# EAGLE board OpenBook (EAGLE 9.7.0)
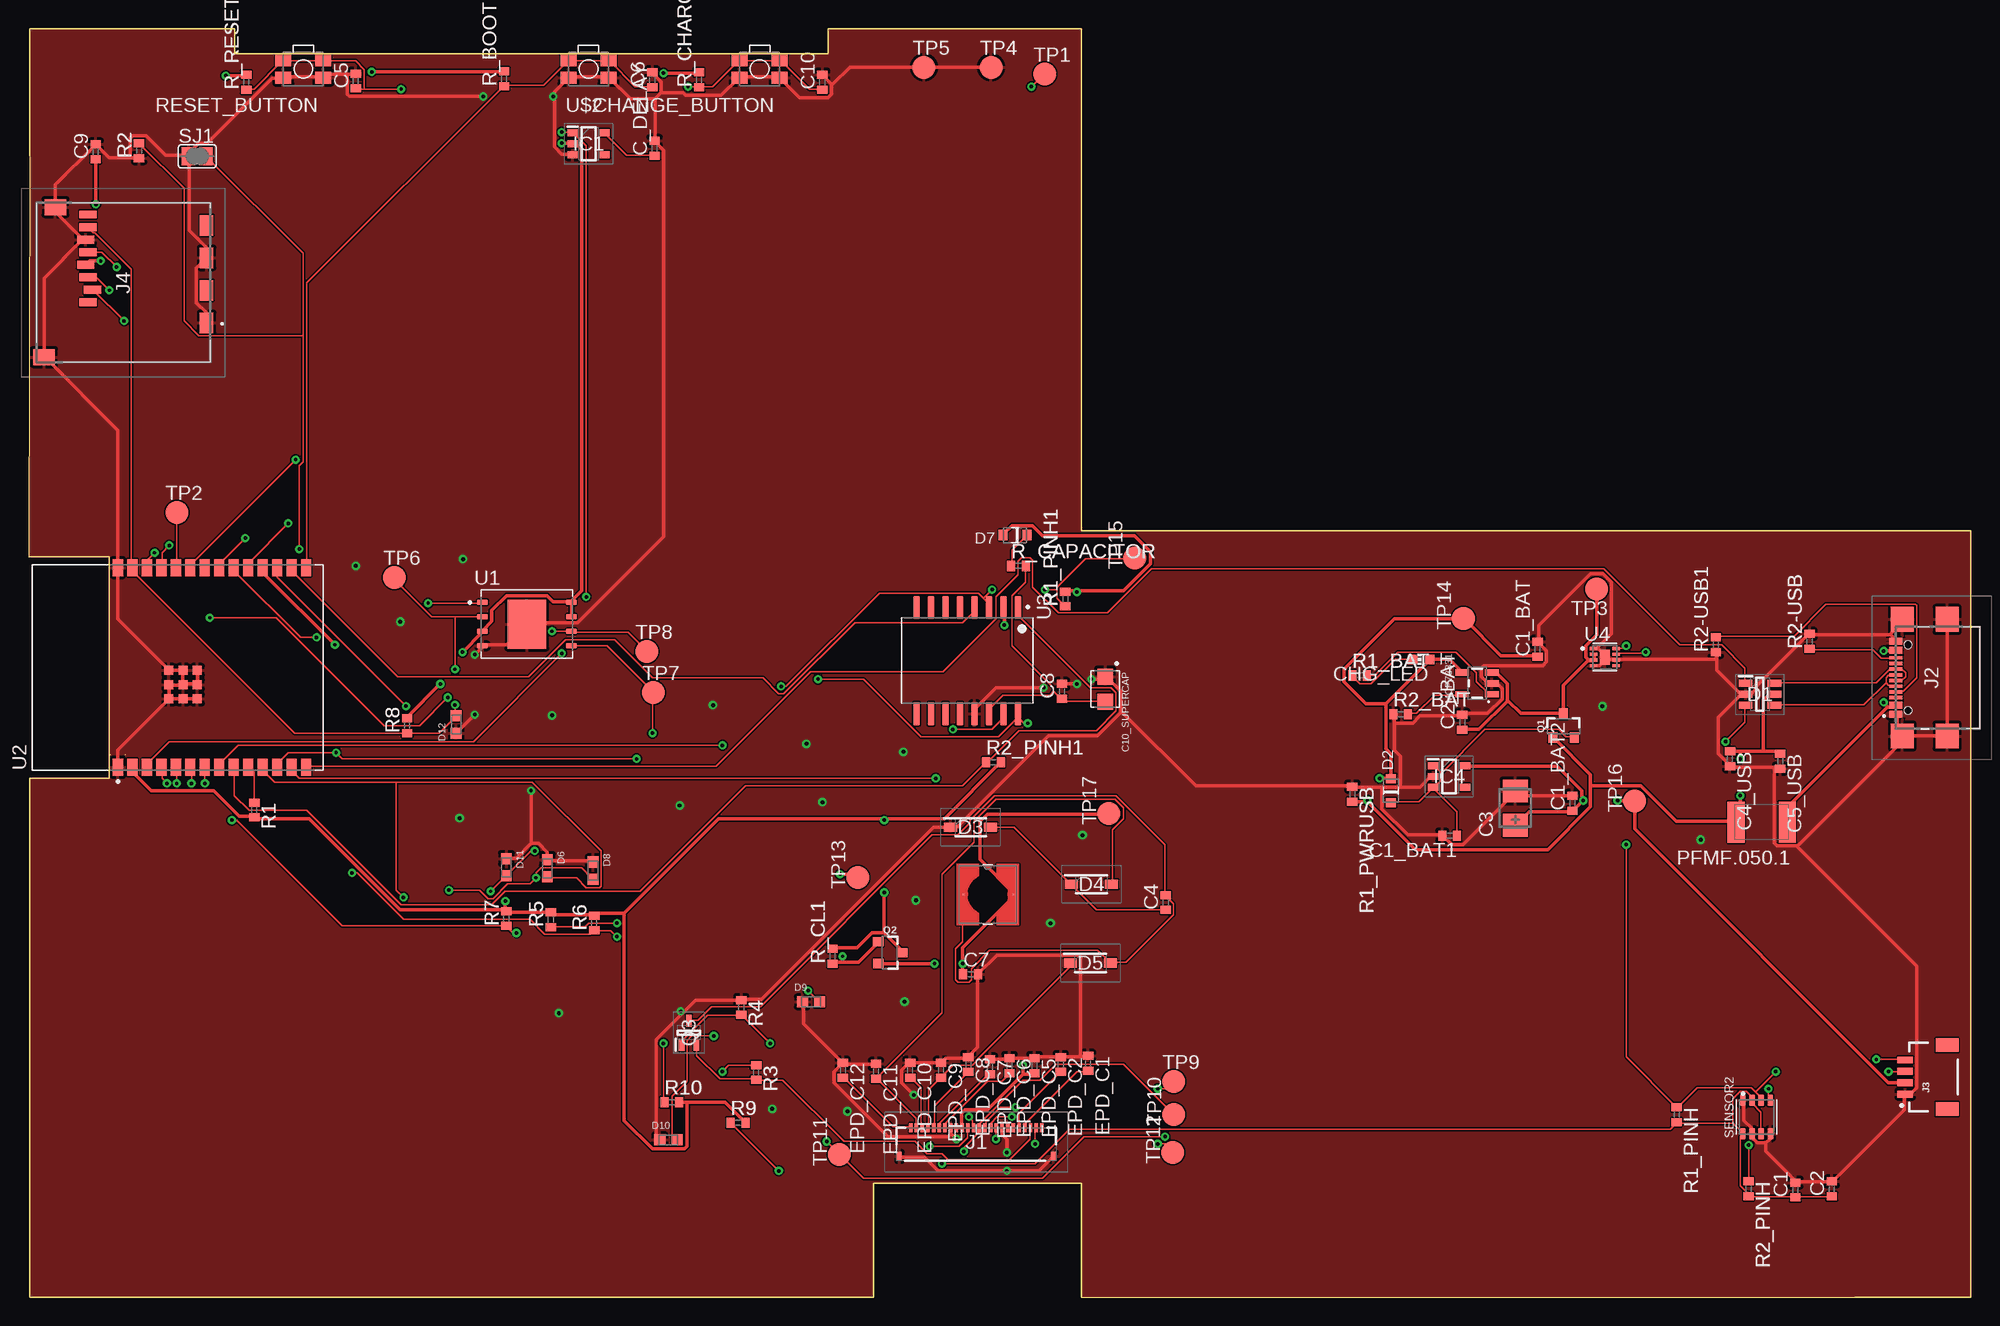
[diagram p1: board, top side]
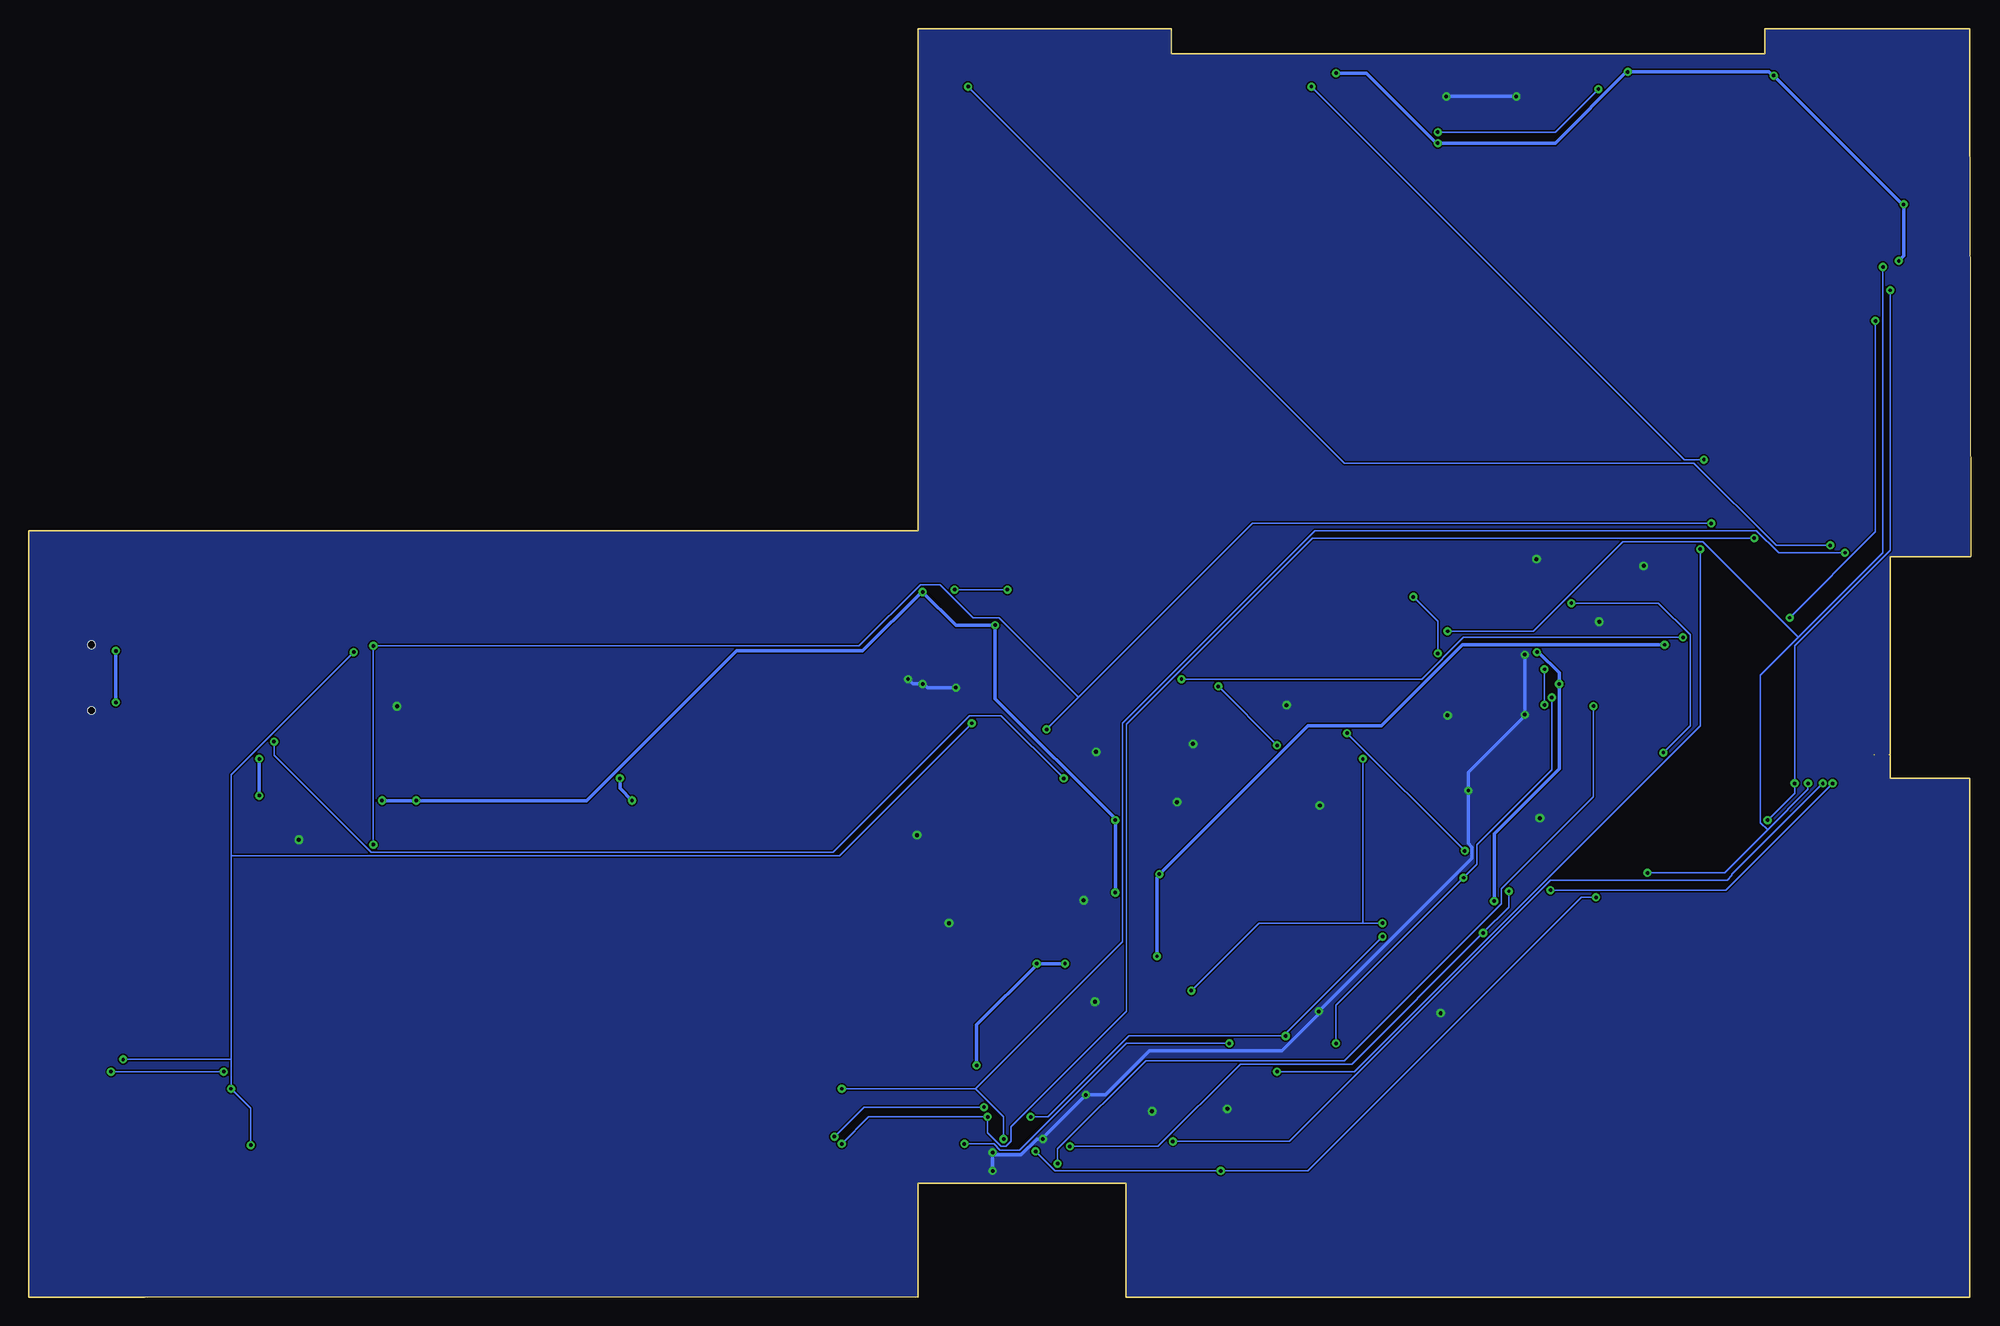
[diagram p2: board, bottom side, seen from below]

Size 170.29 x 111.2 mm. Coordinates in mm from the lower left corner, seen from the top.
Outline: 7.18,47.53 7.09,47.53
Outline: 8.48,47.53 8.49,47.53
Outline: 7.09,47.53 7.09,64.9 0,64.9 0.09,100 0.09,111.2 18.09,111.2 18.09,109 70.09,109 70.09,111.2 92.29,111.2 92.29,67.2 170.29,67.2 170.29,0 160.09,0 92.29,0 92.29,10 74.09,10 74.09,0 0.09,0 0.09,45.5 7.09,45.5 7.09,47.53
Copper layers (1*16): Top 0.035mm / dielectric 1.5mm / Bottom 0.035mm
Design rules "Fusion Electronics Design Rules *": minimum track width 0.15mm, minimum drill 0.3mm, track to track 0.13mm, track to pad 0.13mm, pad to pad 0.13mm, via to via 0.13mm, smd to smd 0.13mm, copper to edge 0mil, drill to drill 0.15mm, minimum pad ring 10mil, minimum via ring 8mil, stop-mask expansion 4mil, vias tented up to drill 9999mil, thermal gap 10mil
Net classes: 0 default: width 0.05 mm; 1 Power: width 0.3 mm; 2 Signal: width 0.15 mm

## Footprints (pad centres in the part's own frame; a part is rotated, then mirrored left to right if it is on the bottom)
ESP32_WROVER_EAGLE-LTSPICE_C0402 = smd 0.7 x 0.9: 1 -0.65,0; 2 0.65,0
RCL_CT3528 = smd 2 x 2.2: + -1.5,0; - 1.5,0
CAPCP3225X100N = smd 1.4 x 1.4: 1 -1.1,0; 2 1.1,0
MYBUTTON = smd 1.4 x 1.05: 1 1.75,0.75; 2 -1.75,0.75; 3 -1.75,-0.75; 4 1.75,-0.75
ADAFRUIT_CHIP-LED0603 = smd 0.8 x 0.8: A 0,-0.75; C 0,0.75
SOT95P280X145-6N = smd 1.2 x 0.6: 1 -1.25,0.95; 2 -1.25,0; 3 -1.25,-0.95; 4 1.25,-0.95; 5 1.25,0; 6 1.25,0.95
ESP32_WROVER_AVX---SD0805S020S1R0_AVX_SD0805S020S1R0_0 = smd 0.8 x 0.9: 1 -1.05,0; 2 1.05,0
SOD3716X135N = smd 1.15 x 0.8: 1 -1.75,0; 2 1.75,0
DIOC1608X36N = smd 0.97 x 0.94: 1 -0.75,0; 2 0.75,0
SOT95P280X125-5N = smd 0.9 x 0.6: 1 -1.4,0.95; 2 -1.4,0; 3 -1.4,-0.95; 4 1.4,-0.95; 5 1.4,0.95
SOT95P280X120-5N = smd 0.9 x 0.6: 1 -1.4,0.95; 2 -1.4,0; 3 -1.4,-0.95; 4 1.4,-0.95; 5 1.4,0.95
FH34SRJ24S05SH99 = smd 0.3 x 0.8: 1 5.75,1.45; 2 5.25,1.45; 3 4.75,1.45; 4 4.25,1.45; 5 3.75,1.45; 6 3.25,1.45; 7 2.75,1.45; 8 2.25,1.45; 9 1.75,1.45; 10 1.25,1.45; 11 0.75,1.45; 12 0.25,1.45; 13 -0.25,1.45; 14 -0.75,1.45; 15 -1.25,1.45; 16 -1.75,1.45; 17 -2.25,1.45; 18 -2.75,1.45; 19 -3.25,1.45; 20 -3.75,1.45; 21 -4.25,1.45; 22 -4.75,1.45; 23 -5.25,1.45; 24 -5.75,1.45 | smd 0.4 x 0.8: MP1 6.75,-1.05; MP2 -6.75,-1.05
SAMACSYS_PARTS_USB4110GFA = smd 0.3 x 1.15: A1 -3.35,3.678; A4 -2.55,3.678; A5 -1.25,3.678; A6 -0.25,3.678; A7 0.25,3.678; A8 1.25,3.678; A9 2.55,3.678; A12 3.35,3.678; B1 3.05,3.678; B4 2.25,3.678; B5 1.75,3.678; B6 0.75,3.678; B7 -0.75,3.678; B8 -1.75,3.678; B9 -2.25,3.678; B12 -3.05,3.678 | smd 2.18 x 2: MP1 -5.11,-0.827; MP2 5.11,-0.827; MP3 -5.11,3.103; MP4 5.11,3.103 | hole 0.65: -2.89,2.603; 2.89,2.603
JST04_1MM_RA = smd 0.6 x 1.35: 1 -1.5,0; 2 -0.5,0; 3 0.5,0; 4 1.5,0 | smd 1.2 x 2: NC1 2.8,-3.675; NC2 -2.8,-3.675
112ATAARR03ATTEND = smd 1.8 x 1.2: G1 10.6,10.4; G2 4.9,10.4; S1 7.75,10.4; S2 2.05,10.4 | smd 1.4 x 1.9: G3 13.6,-3.85; G4 0.45,-2.85 | smd 0.7 x 1.5: P1 8.8,0; P2 7.7,0.4; P3 6.6,0; P4 5.5,-0.2; P5 4.4,0; P6 3.3,-0.2; P7 2.2,0; P8 1.1,0
IND_4828-WE-TPC_WRE = smd 0.127 x 0.127: 1 -2.159,0; 2 2.286,0
ESP32_WROVER_SPARKFUN-IC-POWER_SOT23-5 = smd 0.55 x 1.2: 1 -0.95,-1.3; 2 0,-1.3; 3 0.95,-1.3; 4 0.95,1.3; 5 -0.95,1.3
ESP32C6_VARISTOR_CT/CN1812 = smd 1.5 x 3.6: 1 -2.25,0; 2 2.25,0
ESP32_WROVER_SPARKFUN-DISCRETESEMI_SOT23-3 = smd 0.8 x 0.9: 1 -0.95,-1; 2 0.95,-1; 3 0,1.1
SOT65P210X110-3N = smd 1.05 x 0.5: 1 -1.05,0.65; 2 -1.05,-0.65; 3 1.05,0
ESP32_WROVER_EAGLE-LTSPICE_R0402 = smd 0.7 x 0.9: 1 -0.65,0; 2 0.65,0
ESP32_WROVER_BME680_PSON80P300X300X100-8N = smd 1.016 x 0.5: 1 1.458,1.2; 2 1.458,0.4; 3 1.458,-0.4; 4 1.458,-1.2; 5 -1.458,-1.22; 6 -1.458,-0.4; 7 -1.458,0.4; 8 -1.458,1.2
SJ = smd 1.168 x 1.6: 1 -0.762,0; 2 0.762,0
TP20R = smd 2 x 2: TP 0,0
SON127P600X800X80-9N = smd 0.94 x 0.44: 1 -3.895,1.905; 2 -3.895,0.635; 3 -3.895,-0.635; 4 -3.895,-1.905; 5 3.895,-1.905; 6 3.895,-0.635; 7 3.895,0.635; 8 3.895,1.905 | smd 3.4 x 4.3: 9 0,0
XCVR_ESP32-C6-WROOM-1-N8 = smd 1.5 x 0.9: 1 -8.75,5.26; 2 -8.75,3.99; 3 -8.75,2.72; 4 -8.75,1.45; 5 -8.75,0.18; 6 -8.75,-1.09; 7 -8.75,-2.36; 8 -8.75,-3.63; 9 -8.75,-4.9; 10 -8.75,-6.17; 11 -8.75,-7.44; 12 -8.75,-8.71; 13 -8.75,-9.98; 14 -8.75,-11.25; 15 8.75,-11.25; 16 8.75,-9.98; 17 8.75,-8.71; 18 8.75,-7.44; 19 8.75,-6.17; 20 8.75,-4.9; 21 8.75,-3.63; 22 8.75,-2.36; 23 8.75,-1.09; 24 8.75,0.18; 25 8.75,1.45; 26 8.75,2.72; 27 8.75,3.99; 28 8.75,5.26 | smd 0.8 x 0.8: 29_1 -2.755,0.79; 29_2 -1.505,0.79; 29_3 -0.255,0.79; 29_4 -2.755,-0.46; 29_5 -1.505,-0.46; 29_6 -0.255,-0.46; 29_7 -2.755,-1.71; 29_8 -1.505,-1.71; 29_9 -0.255,-1.71
SOIC127P1032X265-16N = smd 2.05 x 0.59: 1 -4.655,4.445; 2 -4.655,3.175; 3 -4.655,1.905; 4 -4.655,0.635; 5 -4.655,-0.635; 6 -4.655,-1.905; 7 -4.655,-3.175; 8 -4.655,-4.445; 9 4.655,-4.445; 10 4.655,-3.175; 11 4.655,-1.905; 12 4.655,-0.635; 13 4.655,0.635; 14 4.655,1.905; 15 4.655,3.175; 16 4.655,4.445
SON50P200X200X80-9N = smd 0.76 x 0.27: 1 -0.985,0.75; 2 -0.985,0.25; 3 -0.985,-0.25; 4 -0.985,-0.75; 5 0.985,-0.75; 6 0.985,-0.25; 7 0.985,0.25; 8 0.985,0.75 | smd 0.9 x 1.3: 9 0,0

## Placement (x,y rotation side)
C1  100nF  [ESP32_WROVER_EAGLE-LTSPICE_C0402]  154.89,9.4 90 top
C1_BAT  4.7uF  [ESP32_WROVER_EAGLE-LTSPICE_C0402]  132.29,56.8 90 top
C1_BAT1  4.7uF  [ESP32_WROVER_EAGLE-LTSPICE_C0402]  124.59,40.45 180 top
C1_BAT2  4.7uF  [ESP32_WROVER_EAGLE-LTSPICE_C0402]  135.35,43.3 90 top
C2  100nF  [ESP32_WROVER_EAGLE-LTSPICE_C0402]  158.09,9.5 90 top
C2_BAT  4.7uF  [ESP32_WROVER_EAGLE-LTSPICE_C0402]  125.69,50.4 90 top
C3  100uF TANT  [RCL_CT3528]  130.33,42.87 90 top
C4  4.7uF/25V  [ESP32_WROVER_EAGLE-LTSPICE_C0402]  99.69,34.6 90 top
C4_USB  100nF  [ESP32_WROVER_EAGLE-LTSPICE_C0402]  149.16,47.2 270 top
C5  1uF  [ESP32_WROVER_EAGLE-LTSPICE_C0402]  28.69,106.6 90 top
C5_USB  4.7uF  [ESP32_WROVER_EAGLE-LTSPICE_C0402]  153.56,46.99 270 top
C6  100nF  [ESP32_WROVER_EAGLE-LTSPICE_C0402]  54.69,106.7 90 top
C7  10uF  [ESP32_WROVER_EAGLE-LTSPICE_C0402]  82.59,28.3 0 top
C8  100nF  [ESP32_WROVER_EAGLE-LTSPICE_C0402]  90.59,53.1 90 top
C9  100nF  [ESP32_WROVER_EAGLE-LTSPICE_C0402]  5.89,100.4 90 top
C10  100nF  [ESP32_WROVER_EAGLE-LTSPICE_C0402]  69.59,106.5 90 top
C10_SUPERCAP  CPH3225A  [CAPCP3225X100N]  94.39,53.3 270 top
C_DELAY  100nF  [ESP32_WROVER_EAGLE-LTSPICE_C0402]  54.89,100.7 90 top
CHANGE_BUTTON  BUTTON_CUSYOMV1BUTTONMODEL  [MYBUTTON]  64.09,107.65 180 top
CHG_LED  [ADAFRUIT_CHIP-LED0603]  122.09,55.9 90 top
D1  USBLC6-2SC6Y  [SOT95P280X145-6N]  151.79,52.85 0 top
D2  ESP32_WROVER_AVX---SD0805S020S1R0_AVX_SD0805S020S1R0_0_0AVX_SD0805S020S1R0_0_0  [ESP32_WROVER_AVX---SD0805S020S1R0_AVX_SD0805S020S1R0_0]  119.44,44.4 90 top
D3  MBR0530COSTUM  [SOD3716X135N]  82.59,41.2 0 top
D4  MBR0530COSTUM  [SOD3716X135N]  93.19,36.2 0 top
D5  MBR0530COSTUM  [SOD3716X135N]  93.09,29.3 0 top
D6  PGB1010603MRCOSTUM  [DIOC1608X36N]  45.49,37.6 270 top
D7  ESP32_WROVER_AVX---SD0805S020S1R0_AVX_SD0805S020S1R0_0_0AVX_SD0805S020S1R0_0_0  [ESP32_WROVER_AVX---SD0805S020S1R0_AVX_SD0805S020S1R0_0]  86.49,66.8 180 top
D8  PGB1010603MRCOSTUM  [DIOC1608X36N]  49.49,37.4 270 top
D9  PGB1010603MRCOSTUM  [DIOC1608X36N]  68.59,25.9 0 top
D10  PGB1010603MRCOSTUM  [DIOC1608X36N]  56.09,13.8 0 top
D11  PGB1010603MRCOSTUM  [DIOC1608X36N]  41.89,37.7 270 top
D12  PGB1010603MRCOSTUM  [DIOC1608X36N]  37.49,50.2 90 top
EPD_C1  1uF/50V  [ESP32_WROVER_EAGLE-LTSPICE_C0402]  92.89,20.5 270 top
EPD_C2  1uF/50V  [ESP32_WROVER_EAGLE-LTSPICE_C0402]  90.49,20.4 270 top
EPD_C5  0.1uF/50V  [ESP32_WROVER_EAGLE-LTSPICE_C0402]  88.19,20.3 270 top
EPD_C6  1uF/50V  [ESP32_WROVER_EAGLE-LTSPICE_C0402]  85.99,20.3 270 top
EPD_C7  1uF/50V  [ESP32_WROVER_EAGLE-LTSPICE_C0402]  84.29,20.2 270 top
EPD_C8  1uF/50V  [ESP32_WROVER_EAGLE-LTSPICE_C0402]  82.39,20.4 270 top
EPD_C9  1uF/50V  [ESP32_WROVER_EAGLE-LTSPICE_C0402]  79.99,19.9 270 top
EPD_C10  1uF/50V  [ESP32_WROVER_EAGLE-LTSPICE_C0402]  77.29,19.9 270 top
EPD_C11  1uF/50V  [ESP32_WROVER_EAGLE-LTSPICE_C0402]  74.29,19.8 270 top
EPD_C12  1uF/50V  [ESP32_WROVER_EAGLE-LTSPICE_C0402]  71.39,19.9 270 top
IC1  BD5229G-TR  [SOT95P280X125-5N]  49.09,101.1 0 top
IC4  XC6220A331MR-G  [SOT95P280X120-5N]  124.54,45.64 0 top
J1  FH34SRJ-24S-0.5SH_99_  [FH34SRJ24S05SH99]  83.09,13.4 0 top
J2  SAMACSYS_PARTS_USB4110-GF-A  [SAMACSYS_PARTS_USB4110GFA]  167.38,54.3 90 top
J3  QWIIC_RIGHT_ANGLE  [JST04_1MM_RA]  164.53,19.3 90 top
J4  112A-TAAR-R03_ATTEND  [112ATAARR03ATTEND]  5.21,96 270 top
L1  68uH  [IND_4828-WE-TPC_WRE]  84.09,35.3 0 top
MCP73831  ESP32_WROVER_SPARKFUN-IC-POWER_MCP73831  [ESP32_WROVER_SPARKFUN-IC-POWER_SOT23-5]  126.99,53.8 90 top
PFMF.050.1  ESP32C6_VARISTORCN1812  [ESP32C6_VARISTOR_CT/CN1812]  151.94,41.65 180 top
Q1  20V/4.2A/52mΩ/1.4W  [ESP32_WROVER_SPARKFUN-DISCRETESEMI_SOT23-3]  134.57,50.06 0 top
Q2  20V/4.2A/52mΩ/1.4W  [ESP32_WROVER_SPARKFUN-DISCRETESEMI_SOT23-3]  75.49,30.2 270 top
Q3  SI1308EDL-T1-GE3  [SOT65P210X110-3N]  57.89,23.2 90 top
R1  10K  [ESP32_WROVER_EAGLE-LTSPICE_R0402]  19.79,42.7 270 top
R1_BAT  200  [ESP32_WROVER_EAGLE-LTSPICE_R0402]  116.69,54.5 0 top
R1_PINH  10K  [ESP32_WROVER_EAGLE-LTSPICE_R0402]  144.49,16 270 top
R1_PINH1  10K  [ESP32_WROVER_EAGLE-LTSPICE_R0402]  90.89,61.2 90 top
R1_PWRUSB  100K  [ESP32_WROVER_EAGLE-LTSPICE_R0402]  116.05,44.1 270 top
R2  2.2  [ESP32_WROVER_EAGLE-LTSPICE_R0402]  9.69,100.5 90 top
R2-USB  5k1  [ESP32_WROVER_EAGLE-LTSPICE_R0402]  156.14,57.49 90 top
R2-USB1  5k1  [ESP32_WROVER_EAGLE-LTSPICE_R0402]  147.92,57.19 90 top
R2_BAT  2K  [ESP32_WROVER_EAGLE-LTSPICE_R0402]  120.29,51.1 0 top
R2_PINH  10K  [ESP32_WROVER_EAGLE-LTSPICE_R0402]  150.79,9.5 270 top
R2_PINH1  10K  [ESP32_WROVER_EAGLE-LTSPICE_R0402]  84.59,46.9 0 top
R3  0.47  [ESP32_WROVER_EAGLE-LTSPICE_R0402]  63.79,19.7 270 top
R4  10K  [ESP32_WROVER_EAGLE-LTSPICE_R0402]  62.49,25.4 270 top
R5  10K  [ESP32_WROVER_EAGLE-LTSPICE_R0402]  45.79,33.1 90 top
R6  10K  [ESP32_WROVER_EAGLE-LTSPICE_R0402]  49.59,32.8 90 top
R7  10K  [ESP32_WROVER_EAGLE-LTSPICE_R0402]  41.89,33.2 90 top
R8  10K  [ESP32_WROVER_EAGLE-LTSPICE_R0402]  33.19,50.1 90 top
R9  10K  [ESP32_WROVER_EAGLE-LTSPICE_R0402]  62.19,15.3 0 top
R10  10K  [ESP32_WROVER_EAGLE-LTSPICE_R0402]  56.39,17.1 0 top
R_BOOT  10K  [ESP32_WROVER_EAGLE-LTSPICE_R0402]  41.69,106.8 90 top
R_CAPACITOR  15  [ESP32_WROVER_EAGLE-LTSPICE_R0402]  86.79,64.1 0 top
R_CHARGE  10K  [ESP32_WROVER_EAGLE-LTSPICE_R0402]  58.79,106.7 90 top
R_CL1  10K  [ESP32_WROVER_EAGLE-LTSPICE_R0402]  70.49,29.9 90 top
R_RESET  10K  [ESP32_WROVER_EAGLE-LTSPICE_R0402]  19.09,106.5 90 top
RESET_BUTTON  BUTTON_CUSYOMV1BUTTONMODEL  [MYBUTTON]  24.09,107.65 180 top
SENSOR2  ESP32_WROVER_BME680_BME680  [ESP32_WROVER_BME680_PSON80P300X300X100-8N]  151.49,15.8 90 top
SJ1  [SJ]  14.79,100 0 top
TP1  TP  [TP20R]  89.09,107.2 0 top
TP2  TP  [TP20R]  12.99,68.8 0 top
TP3  TP  [TP20R]  137.49,62.06 180 top
TP4  TP  [TP20R]  84.39,107.8 0 top
TP5  TP  [TP20R]  78.49,107.8 0 top
TP6  TP  [TP20R]  32.09,63.1 0 top
TP7  TP  [TP20R]  54.79,53 0 top
TP8  TP  [TP20R]  54.19,56.6 0 top
TP9  TP  [TP20R]  100.39,18.9 0 top
TP10  TP  [TP20R]  100.39,16 90 top
TP11  TP  [TP20R]  71.09,12.5 90 top
TP12  TP  [TP20R]  100.29,12.69 90 top
TP13  TP  [TP20R]  72.69,36.8 90 top
TP14  TP  [TP20R]  125.79,59.5 90 top
TP15  TP  [TP20R]  96.99,64.8 90 top
TP16  TP  [TP20R]  140.79,43.5 90 top
TP17  TP  [TP20R]  94.69,42.4 90 top
U1  W25Q512JVEIQ  [SON127P600X800X80-9N]  43.69,59 0 top
U2  ESP32-C6-WROOM-1-N8  [XCVR_ESP32-C6-WROOM-1-N8]  13.09,55.2 90 top
U3  DS3231SN#  [SOIC127P1032X265-16N]  82.29,55.8 270 top
U4  MAX17048G+T10  [SON50P200X200X80-9N]  138.19,56.1 0 top
U$2  BUTTON_CUSYOMV1BUTTONMODEL  [MYBUTTON]  49.09,107.65 180 top

## Tracks (layer width: path | path; a pad name or v marks a point on that pad's centre or on a via)
3V3  (via drill 0.3)
  Top 0.3: v5.9,95.78 5.9,99.65 C9.1 | v6.33,90.84 5.36,90.84 5.04,90.52 J4.P4 | v17.29,107.07 19.01,107.07 R_RESET.2 | v30.09,107.39 41.59,107.39 R_BOOT.2 | v46.75,101.16 47.61,101.16 IC1.2 47.82,101.05 48.04,101.05 48.47,100.62 48.47,61.92 47.61,61.06 U1.8 | v55.67,107.28 58.79,107.28 R_CHARGE.2 | C3.+ 130.38,41.39 131.57,42.57 135.33,42.57 C1_BAT2.1 135.44,42.68 136.19,43.43 136.19,43.54 | 136.19,43.54 136.19,44.4 134.04,46.55 125.98,46.55 IC4.5 | J3.2 164.46,18.81 163.06,18.81 140.81,41.06 140.81,43.43 TP16.TP 140.7,43.54 v139.31,43.54 | v136.3,43.54 136.19,43.54 | U1.7 47.61,59.66 47.61,60.84 U1.8 | v36.11,53.75 33.2,50.85 R8.2 | v38.04,56.55 39.76,58.27 U1.3 39.87,58.48 40.62,59.23 40.62,60.2 41.91,61.49 45.46,61.49 46,60.95 47.5,60.95 U1.8 | 91.9,61.92 95.98,61.92 98.35,64.28 98.35,65.36 96.95,66.76 88.89,66.76 88.03,67.62 86.2,67.62 85.45,66.86 D7.2 | 91.9,61.92 90.93,61.92 R1_PINH1.2 | v85.56,58.91 85.56,60.41 U3.2 | v91.9,61.81 91.9,61.92 | U2.2 9.12,46.44 9.12,46.01 10.74,44.4 16.22,44.4 18.48,42.14 19.77,42.14 R1.2 19.87,41.92 24.6,41.92 32.56,33.97 41.8,33.97 R7.2 | 57.71,17.09 61.05,17.09 62.77,15.37 R9.2 | 57.71,17.09 57.07,17.09 R10.2 | 75.02,31.93 73.95,31.93 72.66,30.64 70.51,30.64 R_CL1.2 | 75.02,31.93 76.53,30.42 76.53,30.21 Q2.3 | R7.2 41.91,33.76 45.67,33.76 R5.2 45.89,33.65 46,33.54 49.54,33.54 R6.2 49.65,33.65 52.23,33.65 | 75.02,41.92 60.51,41.92 52.23,33.65 | 75.02,41.92 80.29,41.92 85.23,46.87 R2_PINH1.2 | v75.02,35.48 75.02,31.93 | v75.02,41.82 75.02,41.92 | 57.71,17.09 57.71,13.22 57.5,13.01 54.7,13.01 52.23,15.48 52.23,33.65 | v41.8,34.72 41.8,34.08 R7.2
  Bottom 0.3: v6.33,90.84 5.9,91.27 v5.9,95.78 6.01,95.78 v17.29,107.07 17.4,107.07 17.72,107.39 v30.09,107.39 30.19,107.39 36.43,101.16 v46.75,101.16 46.86,101.16 52.98,107.28 v55.67,107.28 | v139.31,43.54 v136.3,43.54 121.35,43.54 108.24,56.65 97.17,56.65 92.01,61.81 v91.9,61.81 89,58.91 v85.56,58.91 85.56,52.46 75.02,41.92 v75.02,41.82 v75.02,35.48 | v38.04,56.55 37.93,56.55 36.11,54.72 v36.11,53.75 36.11,46.33 41.8,40.63 v41.8,34.72
32KHZ
  Top 0.15: U3.1 86.74,59.77 93.08,53.43 94.91,53.43 95.34,53 95.34,51.38 93.62,49.66 86.85,49.66 84.16,46.98 83.94,46.98 R2_PINH1.1 83.94,46.87 81.9,44.83 62.87,44.83 53.63,35.58 41.8,35.58 40.62,34.4 32.67,34.4 24.39,42.68 19.34,42.68 18.05,43.97 18.05,46.44 U2.9
DN
  Top 0.15: 162.85,53.86 163.06,53.64 163.6,53.64 J2.B7 | 162.85,53.86 162.85,54.29 163.06,54.5 163.6,54.5 J2.A7 | 162.85,53.86 160.91,51.92 153.07,51.92 D1.4
DP
  Top 0.15: J2.A6 163.71,54.07 164.25,54.07 164.57,54.4 164.57,54.72 164.25,55.04 163.71,55.04 J2.B6 163.6,55.04 163.17,55.04 161.99,53.86 153.07,53.86 D1.6
EPD_3V3  (via drill 0.3)
  Top 0.3: J1.16 81.36,14.84 81.79,14.84 J1.15 81.79,14.94 81.79,16.12 82.12,16.45 84.05,16.45 87.17,19.57 | 87.17,19.57 88.14,19.57 EPD_C5.2 | v79.43,29.24 74.59,29.24 Q2.2 | C7.1 81.9,28.38 v81.9,29.24 81.9,30.64 86.42,35.15 86.42,35.26 | 86.42,35.26 86.42,35.37 83.41,38.38 83.41,41.71 84.05,42.35 94.69,42.35 TP17.TP | 86.42,35.26 L1.2 | v87.17,20.32 87.17,19.57
  Bottom 0.3: v79.43,29.24 v81.9,29.24 81.9,29.13 87.17,23.86 v87.17,20.32
EPD_3V3_C  (via drill 0.3)
  Top 0.3: 71.37,29.35 72.76,29.35 74.48,31.07 Q2.1 | 71.37,29.35 70.51,29.35 R_CL1.1 | v26.86,57.19 20.63,63.42 20.63,63.85 U2.18 | v71.15,37.09 72.44,37.09 72.66,36.87 TP13.TP | v71.37,29.89 71.37,29.35
  Bottom 0.3: v26.86,57.19 44.6,57.19 51.69,50.09 58.14,50.09 v71.15,37.09 71.15,36.98 71.37,36.77 v71.37,29.89
EPD_BUSY  (via drill 0.3)
  Top 0.15: v84.8,13.87 84.8,14.84 J1.9 | v98.99,18.27 99.85,18.27 100.39,18.81 TP9.TP | v11.06,65.25 10.41,64.61 10.41,63.96 U2.26
  Bottom 0.15: v84.8,13.87 84.8,15.8 87.28,18.27 | v98.99,18.27 87.28,18.27 | v11.06,65.25 16.86,65.25 18.8,67.19 57.5,67.19 74.38,50.31 74.38,31.18 87.28,18.27
EPD_CS  (via drill 0.3)
  Top 0.15: 32.24,45.15 21.59,45.15 20.63,46.12 20.63,46.44 U2.11 | 32.24,45.15 44.17,45.15 50.19,39.13 50.19,36.01 50.08,35.91 48.9,35.91 48.04,36.77 45.57,36.77 D6.2 | TP10.TP 100.39,16.02 95.98,20.43 90.07,20.43 88.67,19.03 87.17,19.03 83.41,15.27 83.41,14.94 J1.12 83.3,14.84 83.3,14.4 82.01,13.12 v82.01,12.79 | v65.78,11.07 61.58,15.27 R9.1 | 32.24,45.15 32.24,35.69 v32.88,35.05
  Bottom 0.15: v82.01,12.79 80.29,11.07 v65.78,11.07 58.14,11.07 34.17,35.05 v32.88,35.05
EPD_DC  (via drill 0.3)
  Top 0.15: v86.52,16.66 85.23,16.66 83.94,15.37 83.94,14.94 J1.11 | v99.64,14.08 92.54,14.08 88.89,10.43 73.19,10.43 71.15,12.47 TP11.TP 71.04,12.58 v69.97,13.65 | v12.99,45.04 12.99,46.44 U2.5
  Bottom 0.15: v86.52,16.66 97.06,16.66 v99.64,14.08 | v12.99,45.04 20.95,37.09 20.95,36.98 21.38,36.55 36.86,36.55 59.76,13.65 v69.97,13.65
EPD_RST  (via drill 0.3)
  Top 0.15: v86.2,15.8 84.91,15.8 84.37,15.27 84.37,14.94 J1.10 | v98.99,13.44 99.64,13.44 100.28,12.79 TP12.TP | v19.01,66.54 16.76,64.28 16.76,63.96 U2.21
  Bottom 0.15: v98.99,13.44 96.63,15.8 v86.2,15.8 86.2,14.4 85.02,13.22 84.59,13.22 84.16,13.65 84.16,14.94 74.05,25.05 74.05,50.2 57.71,66.54 v19.01,66.54
FLASH_CS  (via drill 0.3)
  Top 0.15: v51.59,32.79 49.11,32.79 48.79,32.47 45.89,32.47 R5.1 | v68.36,26.88 69.32,25.91 D9.2 | v35.03,60.84 39.76,60.84 U1.1 | U2.12 21.81,46.55 21.81,46.76 22.78,47.73 v26.97,47.73 27.51,47.19 v53.31,47.19
  Bottom 0.15: 53.31,32.79 62.44,32.79 v68.36,26.88 | 53.31,32.79 v51.59,32.79 | v35.03,60.84 27.4,60.84 24.6,58.05 24.6,50.09 v26.97,47.73 | v53.31,47.19 53.31,32.79
GDR  (via drill 0.3)
  Top 0.15: v88.24,13.44 88.24,14.84 J1.2 | v65.02,22.25 62.55,24.73 R4.2 62.44,24.73 59.54,24.73 57.28,22.47 57.28,22.25 Q3.1
  Bottom 0.15: v88.24,13.44 85.66,13.44 85.13,12.9 83.41,12.9 74.05,22.25 v65.02,22.25
GND  (via drill 0.3, 0.35)
  Top 0.3: C1_BAT2.2 135.33,43.97 130.71,43.97 130.38,44.29 C3.- 130.28,44.18 125.76,39.67 124.79,39.67 124.04,40.42 C1_BAT1.2 123.93,40.53 120.92,40.53 118.67,42.78 118.67,44.72 | 120.28,44.72 122,44.72 122.86,45.58 123.07,45.58 IC4.2 | 120.28,44.72 118.67,44.72 | 118.67,44.72 116.09,44.72 R1_PWRUSB.1 115.98,44.83 102.33,44.83 95.88,51.28 95.77,51.28 | 119.74,50.31 119.74,47.95 120.28,47.41 120.28,44.72 | 119.74,50.31 119.74,51.06 R2_BAT.1 | 119.74,50.31 121.35,50.31 122,50.95 125.65,50.95 C2_BAT.2 125.76,51.17 127.91,51.17 129.2,52.46 129.2,53.32 128.77,53.75 128.34,53.75 MCP73831.2 128.23,53.86 127.91,53.86 127.37,54.4 127.37,55.15 127.59,55.36 132.75,55.36 133.07,55.69 133.07,56.65 132.32,57.41 C1_BAT.2 132.43,57.51 132.43,58.91 136.94,63.42 138.02,63.42 138.77,62.67 138.77,58.16 137.59,56.98 137.59,56.87 | 152.31,13.54 151.56,13.54 151.13,13.97 151.13,14.3 SENSOR2.7 151.02,14.4 151.02,14.84 150.38,15.48 150.38,17.2 SENSOR2.1 | 152.31,13.54 152.64,13.87 152.64,14.3 SENSOR2.5 | 152.31,13.54 152.31,12.79 154.89,10.21 C1.2 154.89,10.11 158.01,10.11 C2.2 158.23,10.21 164.46,16.45 164.46,17.74 J3.1 164.68,17.84 165,17.84 165.54,18.38 165.54,29.02 155.11,39.45 155.11,39.56 | J2.B12 163.71,51.17 163.71,50.95 J2.A1 163.82,50.85 163.82,49.66 164.25,49.23 J2.MP3 | J2.MP3 164.35,49.23 168.12,49.23 J2.MP1 168.22,49.34 168.22,59.34 J2.MP2 | 163.28,58.05 156.18,58.05 R2-USB.2 156.08,57.94 155.86,57.94 151.45,53.53 151.45,53.32 151.13,53 150.59,53 D1.2 | 163.28,58.05 163.6,57.73 J2.A12 163.71,57.51 163.71,57.41 J2.B1 | J2.MP4 164.25,59.34 164.25,59.12 163.28,58.16 163.28,58.05
  Top 0.3: 153.07,46.44 149.3,46.44 149.2,46.55 C4_USB.2 149.09,46.66 148.12,47.62 148.12,50.85 150.06,52.78 D1.2 | 153.07,46.44 153.5,46.44 C5_USB.2 | U4.4 137.26,55.36 137.69,55.36 138.12,55.79 138.12,56.01 U4.9 | U4.9 138.23,55.9 139.09,55.9 U4.6 139.31,55.9 148.01,55.9 | 137.59,56.87 137.26,56.87 U4.1 | 137.59,56.87 138.23,56.22 U4.9 | 148.01,55.9 148.01,54.93 150.06,52.89 150.49,52.89 D1.2 | 148.01,55.9 148.01,56.44 R2-USB1.1 | 155.11,39.56 164.14,48.59 164.14,49.13 J2.MP3 | 155.11,39.56 153.28,39.56 153.07,39.77 153.07,46.44 | U2.29_1 12.35,52.46 12.35,53.64 U2.29_2 12.46,53.64 13.42,53.64 U2.29_5 | U2.29_1 12.46,52.46 13.53,52.46 U2.29_4 13.64,52.46 14.71,52.46 U2.29_7 | U2.1 7.83,47.95 12.24,52.35 U2.29_1 | U2.29_5 13.53,53.75 13.53,54.83 U2.29_6 13.53,54.93 12.35,54.93 U2.29_3 12.24,55.04 7.83,59.45 U2.28 7.83,76 1.49,82.34 J4.G3 1.38,82.45 1.38,89.33 4.72,92.67 J4.P6 4.93,92.77 4.72,92.77 2.46,95.03 2.46,95.46 J4.G4 2.35,95.67 2.35,97.5 5.79,100.94 C9.2 7.08,99.87 8.91,99.87 | U2.29_5 13.64,53.75 14.71,53.75 U2.29_8 14.82,53.86 14.82,54.93 U2.29_9 | J4.G1 15.57,85.46 15.57,86.32 14.71,87.18 14.71,90.19 15.57,91.05 J4.G2 15.57,91.16 15.57,92.02 14.07,93.53 14.07,99.87 SJ1.1 | 27.94,107.18 26.11,107.18 25.89,106.96 RESET_BUTTON.2 25.79,106.96 22.35,106.96 RESET_BUTTON.1 22.24,106.86 21.38,106.86 15.68,101.16 14.93,101.16 13.96,100.19 SJ1.1 | 27.94,107.18 28.69,107.18 C5.2 | 8.91,99.87 9.66,99.87 R2.1 | 8.91,99.87 8.91,101.59 9.12,101.8 10.31,101.8 12.03,100.08 13.96,100.08 SJ1.1 | 54.92,105.03 54.92,101.37 C_DELAY.2 54.92,101.27 55.67,100.51 55.67,66.65 48.15,59.12 43.74,59.12 U1.9 43.63,58.91 41.91,57.19 39.87,57.19 U1.4 39.76,56.98 v39.12,56.33
  Top 0.3: 55.46,105.56 54.92,105.03 | 55.46,105.56 55.46,106.53 54.7,107.28 C6.2 | 46.1,105.24 46.1,105.67 47.29,106.86 U$2.1 47.39,106.96 50.83,106.96 U$2.2 50.94,106.86 52.77,105.03 54.92,105.03 | 46.1,105.24 46.1,100.83 46.75,100.19 47.61,100.19 IC1.3 | TP4.TP 84.37,107.82 78.57,107.82 TP5.TP 78.35,107.82 72.01,107.82 70.51,106.32 70.4,106.32 | 70.4,106.32 69.65,107.07 C10.2 | 70.4,106.32 70.4,105.46 70.08,105.14 67.6,105.14 65.88,106.86 CHANGE_BUTTON.2 65.78,106.96 62.44,106.96 CHANGE_BUTTON.1 62.23,106.86 60.72,105.35 57.61,105.35 57.39,105.56 55.46,105.56 | EPD_C7.1 84.37,20.86 85.99,20.86 EPD_C6.1 86.09,20.96 88.14,20.96 EPD_C5.1 88.24,21.07 90.39,21.07 EPD_C2.1 90.61,21.07 92.22,21.07 | 92.22,21.07 92.87,21.07 EPD_C1.1 | 92.22,21.07 92.22,29.89 92.11,29.99 84.91,29.99 83.3,28.38 C7.2 83.19,28.27 83.19,21.93 82.44,21.18 EPD_C8.1 82.33,20.96 80.4,20.96 80.07,20.64 EPD_C9.1 79.97,20.53 77.39,20.53 EPD_C10.1 77.17,20.53 76.53,19.89 76.53,18.81 v77.6,17.74 | J1.MP1 88.57,11.07 v85.77,11.07 79.75,11.07 78.57,12.26 76.42,12.26 J1.MP2 | v85.77,12.69 85.77,13.87 85.34,14.3 85.34,14.84 J1.8 | 80.83,14.3 80.83,14.84 J1.17 | 80.83,14.3 80.61,14.08 75.34,14.08 70.61,18.81 70.61,19.78 71.37,20.53 EPD_C12.1 | EPD_C11.1 74.27,20.43 71.47,20.43 EPD_C12.1 | D9.1 67.93,25.8 67.93,23.97 71.26,20.64 EPD_C12.1 | v81.36,13.87 80.93,14.3 80.83,14.3 | D8.1 49.44,38.16 49.33,38.27 45.57,38.27 D6.1 45.46,38.48 45.46,39.02 44.71,39.77 44.06,39.77 | 44.06,39.77 42.77,38.48 41.91,38.48 D11.1 | v39.12,51.06 D12.1 | v44.06,44.4 44.06,39.77 | 57.34,24.89 55.03,22.57 55.03,14.08 55.24,13.87 D10.1
  Top 0.3: 57.34,24.89 58.47,26.02 62.44,26.02 R4.1 62.55,26.12 64.27,26.12 79.32,41.17 80.72,41.17 D3.1 80.93,41.28 81.47,41.28 89.43,49.23 93.73,49.23 95.77,51.28 | v91.9,53.75 C8.2 | v93.19,54.18 94.16,54.18 94.37,54.4 C10_SUPERCAP.1 94.48,54.4 95.77,53.1 95.77,51.28 | v89,53.43 84.8,53.43 82.98,51.6 82.98,51.17 U3.13 | 57.34,24.89 v57.18,25.05 | 27.94,107.18 27.94,105.46 28.15,105.24 v39.87,105.24 | v46,105.24 46.1,105.24
  Bottom 0.3: v85.77,11.07 v85.77,12.69 85.66,12.47 83.3,12.47 81.9,13.87 v81.36,13.87 81.36,13.97 v77.6,17.74 75.88,17.74 72.01,21.61 60.4,21.61 57.18,24.83 v57.18,25.05 43.74,38.48 43.74,39.45 44.06,39.77 v44.06,44.4 44.06,46.01 39.12,50.95 v39.12,51.06 v39.12,56.33 | v93.19,54.18 92.76,53.75 v91.9,53.75 91.79,53.75 91.47,53.43 v89,53.43 | v46,105.24 v39.87,105.24
  other vias: 68.19,48.5 57.09,43.1 45.89,51 89.59,32.8 92.39,40.5 77.79,34.8 69.59,43.4 38.09,64.7 37.79,42 46.49,24.9 28.69,64.1 32.59,59.2 65.19,16.5 71.79,16.3 76.79,25.9 76.69,47.8 59.99,51.9 137.99,51.8 146.59,40.1
  pour Top: 74.05,10.06 74.08,10.08 92.31,10.08 92.34,10.06 92.36,10.04 92.37,10.02 92.37,0.08 170.22,0.08 170.22,67.12 92.28,67.12 92.25,67.14 92.23,67.16 92.22,67.18 92.22,111.12 70.17,111.12 70.17,108.98 70.16,108.96 70.14,108.94 70.11,108.92 18.08,108.92 18.05,108.94 18.03,108.96 18.02,108.98 18.02,111.12 0.17,111.12 0.17,64.98 7.11,64.98 7.14,64.96 7.16,64.94 7.17,64.92 7.17,45.48 7.16,45.46 7.14,45.44 7.11,45.42 0.17,45.42 0.17,0.08 74.02,0.08 74.02,10.02 74.03,10.04
  pour Bottom: 74.05,10.06 74.08,10.08 92.31,10.08 92.34,10.06 92.36,10.04 92.37,10.02 92.37,0.08 170.22,0.08 170.22,67.12 92.28,67.12 92.25,67.14 92.23,67.16 92.22,67.18 92.22,111.12 70.17,111.12 70.17,108.98 70.16,108.96 70.14,108.94 70.11,108.92 18.08,108.92 18.05,108.94 18.03,108.96 18.02,108.98 18.02,111.12 0.17,111.12 0.17,64.98 7.11,64.98 7.14,64.96 7.16,64.94 7.17,64.92 7.17,45.48 7.16,45.46 7.14,45.44 7.11,45.42 0.17,45.42 0.17,0.08 74.02,0.08 74.02,10.02 74.03,10.04
GPIO8
  Top 0.15: R1.1 19.77,43.43 19.77,46.01 19.34,46.44 U2.10
I2C_PW  (via drill 0.3)
  Top 0.15: 154.89,8.81 158.01,8.81 C2.1 | 154.89,8.81 150.81,8.81 R2_PINH.2 150.7,8.92 150.7,9.14 150.06,9.78 150.06,14.08 150.27,14.3 SENSOR2.8 150.27,14.4 149.41,15.27 | 154.89,8.81 C1.1 | SENSOR2.6 151.88,14.4 151.88,16.23 151.13,16.98 151.13,17.2 SENSOR2.2 151.02,17.31 151.02,17.63 150.59,18.06 150.06,18.06 149.41,17.41 149.41,15.27 | 149.41,15.27 144.57,15.27 R1_PINH.2 144.47,15.27 143.93,14.73 91.25,14.73 88.24,11.72 v80.07,11.72 | v33.1,51.81 21.81,63.1 21.81,63.85 U2.17
  Bottom 0.15: v33.1,51.81 33.1,43.86 41.16,35.8 41.16,34.51 54.92,20.75 72.33,20.75 80.07,13.01 v80.07,11.72
INT_RTC  (via drill 0.3)
  Top 0.15: 90.18,62.03 90.18,62.24 92.65,64.72 96.95,64.72 TP15.TP | 90.18,62.03 90.18,61.27 90.82,60.63 R1_PINH1.1 | v60.83,48.38 18.37,48.38 16.76,46.76 16.76,46.55 U2.8 | v65.99,53.53 66.42,53.53 74.59,61.7 83.3,61.7 83.73,61.27 | 83.73,61.27 84.16,60.84 84.16,60.52 U3.3 | v89.1,62.03 90.18,62.03 | 83.73,61.27 v84.48,62.03
  Bottom 0.15: v65.99,53.53 v60.83,48.38 | v84.48,62.03 v89.1,62.03
IO/BOOT
  Top 0.15: C6.1 54.6,106.1 53.2,106.1 50.94,108.36 U$2.3 50.83,108.36 47.39,108.36 U$2.4 47.29,108.36 45.14,106.21 41.7,106.21 R_BOOT.1 41.59,106.1 24.39,88.9 24.39,63.96 U2.15
IO/CHARGE  (via drill 0.3)
  Top 0.15: C10.1 69.54,105.89 68.46,105.89 65.88,108.47 CHANGE_BUTTON.3 65.78,108.36 62.44,108.36 CHANGE_BUTTON.4 62.34,108.47 59.97,106.1 58.9,106.1 R_CHARGE.1 58.79,106.1 v57.82,106.1 | v23.42,73.42 14.28,64.28 14.28,63.96 U2.23
  Bottom 0.15: v23.42,73.42 25.14,73.42 v57.82,106.1
MISO  (via drill 0.3)
  Top 0.15: 37.4,59.66 35.35,59.66 32.02,62.99 TP6.TP | 37.4,59.66 39.76,59.66 U1.2 | J4.P7 5.25,93.74 5.68,93.31 5.79,93.31 9.02,90.08 9.02,63.96 U2.27 9.12,63.85 9.12,63.64 23.31,49.45 R8.1 36,49.45 37.4,50.85 D12.2 37.4,50.95 v37.4,51.92 | v37.4,55.04 37.4,59.66
  Bottom 0.15: v37.4,51.92 v37.4,55.04
MOSI  (via drill 0.3)
  Top 0.15: U1.5 47.61,57.08 50.73,57.08 54.7,53.1 TP7.TP 54.7,53 v54.7,49.45 | v79,13.22 81.58,13.22 82.33,13.97 82.33,14.84 J1.14 | v42.77,31.93 42.45,31.93 41.91,32.47 R7.1 41.8,32.57 27.51,32.57 18.26,41.82 v17.83,41.82 | v40.51,35.58 41.8,36.87 D11.2 41.91,36.98 44.06,39.13 v44.38,39.13 | v15.47,45.04 15.47,46.44 U2.7 | v7.08,88.26 6.01,89.33 5.25,89.33 J4.P3
  Bottom 0.15: v79,13.22 71.26,13.22 64.06,20.43 54.27,20.43 v42.77,31.93 40.51,34.19 v40.51,35.58 | v17.83,41.82 15.47,44.18 v15.47,45.04 15.47,57.08 7.08,65.47 v7.08,88.26 | v44.38,39.13 v54.7,49.45
N$1
  Top 0.15: R2-USB1.2 148.01,57.94 154.79,57.94 157.58,60.74 165.43,60.74 165.54,60.63 165.54,54.29 164.35,53.1 163.71,53.1 J2.A5
N$2
  Top 0.15: 123.18,44.61 125.22,42.57 125.22,40.53 C1_BAT1.1 | D2.1 119.53,43.43 121.89,43.43 123.07,44.61 IC4.3 123.18,44.61 | 123.83,45.9 123.83,45.26 123.18,44.61 | 123.83,45.9 123.83,46.01 123.61,46.23 123.5,46.23 123.18,46.55 IC4.1 | 123.83,45.9 127.7,49.77 134.15,49.77 134.79,49.13 135.44,49.13 Q1.2
N$3
  Top 0.15: R1_BAT.2 117.38,54.5 118.02,54.5 120.06,56.55 125.12,56.55 126.94,54.72 126.94,53.97 128.02,52.89 128.23,52.89 MCP73831.1
N$4
  Top 0.15: R2-USB.1 156.18,56.76 161.67,56.76 162.42,56.01 163.6,56.01 J2.B5
N$5
  Top 0.15: CHG_LED.C 119.85,55.9 117.7,53.75 116.73,53.75 116.09,54.4 R1_BAT.1
N$6
  Top 0.15: C4.1 99.64,33.97 93.62,33.97 91.47,36.12 D4.1 91.36,36.23 86.42,41.17 84.37,41.17 D3.2
N$7
  Top 0.15: J1.24 77.28,14.94 75.77,14.94 71.47,19.24 EPD_C12.2
N$8
  Top 0.15: R2_BAT.2 121.03,51.17 121.68,51.17 123.29,52.78 125.65,52.78 MCP73831.5
N$9
  Top 0.15: C_DELAY.1 54.81,100.08 52.45,100.08 50.51,102.02 IC1.5
N$10
  Top 0.15: J1.22 78.25,14.94 78.25,18.38 77.39,19.24 EPD_C10.2
N$11
  Top 0.15: J1.20 79.43,14.94 79.43,16.77 82.33,19.67 EPD_C8.2
N$12
  Top 0.15: R_CAPACITOR.1 86.2,64.18 86.2,65.47 87.49,66.76 D7.1
N$13
  Top 0.15: J1.19 79.86,14.94 79.86,15.27 84.05,19.46 84.27,19.46 EPD_C7.2
N$14
  Top 0.15: J1.18 80.4,14.94 80.4,15.27 84.05,18.92 85.34,18.92 85.99,19.57 EPD_C6.2
N$22
  Top 0.15: J1.5 86.85,14.94 86.85,16.12 90.39,19.67 EPD_C2.2
N$23
  Top 0.15: J1.4 87.38,14.94 87.38,15.27 91.9,19.78 92.87,19.78 EPD_C1.2
PREVGH
  Top 0.15: J1.21 78.89,14.94 78.89,18.17 79.97,19.24 EPD_C9.2 80.07,19.35 81.04,20.32 82.76,20.32 83.08,20.64 83.08,20.75 91.25,28.92 91.25,29.24 D5.1
PREVGL
  Top 0.15: J1.23 77.82,14.94 77.82,15.7 74.38,19.14 EPD_C11.2 74.38,19.24 80.07,24.94 80.07,37.09 82.87,39.88 82.87,41.71 84.8,43.65 95.23,43.65 95.98,42.89 95.98,41.92 95.02,40.96 95.02,36.23 D4.2
RESE
  Top 0.15: J1.3 87.81,14.84 87.81,13.87 85.99,12.04 80.61,12.04 80.07,12.58 78.78,12.58 77.71,13.65 71.47,13.65 66.1,19.03 63.84,19.03 R3.2 63.73,19.14 60.62,19.14 58.57,21.18 58.57,22.14 Q3.2
RESE'  (via drill 0.3)
  Top 0.15: v60.83,19.78 61.37,20.32 63.73,20.32 R3.1 | v23.74,65.58 23.74,72.89 24.07,73.21 24.07,84.28 | 24.07,84.28 24.07,91.48 15.57,99.97 SJ1.2 | 24.07,84.28 14.93,84.28 13.64,85.57 13.64,97.18 9.77,101.05 R2.2
  Bottom 0.15: v60.83,19.78 54.06,19.78 23.74,50.09 v23.74,65.58
RESET  (via drill 0.3)
  Top 0.15: R_RESET.1 19.12,105.89 19.77,105.89 22.24,108.36 RESET_BUTTON.4 22.35,108.36 25.79,108.36 RESET_BUTTON.3 25.89,108.36 28.69,108.36 29.44,107.61 29.44,105.89 | v46.75,102.12 47.61,102.12 IC1.1 47.72,102.12 48.9,100.94 v48.9,61.38 | 29.44,105.89 28.8,105.89 C5.1 | 29.44,105.89 v32.67,105.89 | v46.75,56.44 39.01,48.7 12.35,48.7 10.41,46.76 10.41,46.55 U2.3
  Bottom 0.15: v46.75,102.12 36.43,102.12 v32.67,105.89 | v46.75,56.44 46.75,59.23 v48.9,61.38
RTC_RST
  Top 0.15: U2.16 23.1,63.85 23.1,63.64 32.34,54.4 43.85,54.4 47.07,57.62 51.37,57.62 54.7,54.29 64.38,54.29 65.78,52.89 66.21,52.89 72.44,59.12 81.9,59.12 82.87,60.09 82.87,60.41 U3.4
RX
  Top 0.15: TP2.TP 12.99,63.96 U2.24
SCK  (via drill 0.3)
  Top 0.15: TP8.TP 54.17,56.65 52.55,58.27 47.61,58.27 U1.6 47.5,58.37 v45.89,58.37 | v82.44,15.8 82.76,15.48 82.76,14.94 J1.13 | v60.08,22.9 58.14,22.9 57.71,22.47 57.71,18.92 56.42,17.63 56.42,14.19 56.75,13.87 D10.2 | v51.59,31.61 51.05,32.14 49.65,32.14 R6.1 49.54,32.14 49.22,31.82 45.24,31.82 43.95,33.11 32.88,33.11 28.8,37.2 v28.37,37.2 | v14.28,45.04 14.28,46.44 U2.6 | v7.73,90.3 6.44,91.59 5.25,91.59 J4.P5
  Bottom 0.15: v82.44,15.8 80.93,15.8 73.84,22.9 60.29,22.9 | 60.29,22.9 v51.59,31.61 | 60.29,22.9 v60.08,22.9 | v14.28,45.04 14.28,44.51 17.83,40.96 | 17.83,40.96 21.59,37.2 v28.37,37.2 | v7.73,90.3 7.73,65.25 15.14,57.84 | 15.14,57.84 18.48,54.5 18.48,41.6 17.83,40.96 | v45.89,58.37 38.36,58.37 30.52,66.22 23.53,66.22 15.14,57.84
SCL  (via drill 0.3)
  Top 0.15: v141.78,56.55 141.67,56.44 139.2,56.44 U4.7 | v152.53,18.27 152.53,17.41 152.64,17.31 SENSOR2.4 | v150.81,13.33 150.81,10.21 R2_PINH.1 | v161.99,20.86 164.46,20.86 J3.4 | v25.25,57.84 23.85,57.84 18.05,63.64 18.05,63.85 U2.20 | v69.22,54.18 73.19,54.18 78.25,49.13 85.02,49.13 86.74,50.85 | 86.74,50.85 U3.16 86.74,51.06 | v87.6,50.31 87.28,50.31 86.74,50.85
  Bottom 0.15: v141.78,56.55 152.53,45.8 152.53,38.7 | 152.53,20.86 v152.53,18.27 150.81,16.55 v150.81,13.33 | 152.53,20.86 152.53,38.7 | 152.53,20.86 v161.99,20.86 | v25.25,57.84 44.49,57.84 48.15,54.18 v69.22,54.18 | 152.53,38.7 99.21,38.7 v87.6,50.31
SDA  (via drill 0.3)
  Top 0.15: v140.06,57.08 139.84,56.87 139.2,56.87 U4.8 | v140.06,39.67 140.06,21.07 144.47,16.66 R1_PINH.1 144.57,16.66 146.29,18.38 151.02,18.38 151.35,18.06 | 151.35,18.06 151.88,17.52 151.88,17.31 SENSOR2.3 | v163.06,19.78 164.46,19.78 J3.3 | v153.17,19.78 151.45,18.06 151.35,18.06 | v22.78,67.83 19.34,64.39 19.34,63.96 U2.19 | v81.04,49.77 84.48,49.77 85.45,50.74 85.45,51.06 U3.15
  Bottom 0.15: v140.06,39.67 v140.06,57.08 97.49,57.08 92.11,62.46 90.39,62.46 87.49,59.55 85.23,59.55 78.25,52.57 | v153.17,19.78 v163.06,19.78 | v22.78,67.83 62.98,67.83 78.25,52.57 | v81.04,49.77 78.25,52.57
SRC
  Top 0.15: Q3.3 57.93,24.3 58.68,24.3 59.86,25.48 64.16,25.48 79.21,40.53 81.47,40.53 82.55,41.6 82.55,41.82 84.7,43.97 95.34,43.97 99.64,39.67 99.64,35.26 C4.2 99.75,35.15 100.39,34.51 100.39,33.54 96.2,29.35 94.91,29.35 D5.2 94.8,29.35 93.73,30.42 84.27,30.42 82.65,28.81 82.65,27.84 82.44,27.63 81.47,27.63 81.26,27.84 81.26,30.53 81.9,31.18 81.9,35.26 L1.1
SS_SD  (via drill 0.3)
  Top 0.15: v55.67,22.25 55.67,17.2 R10.1 | D8.2 49.44,36.66 48.47,37.62 44.92,37.62 44.49,37.2 v44.49,36.77 43.95,36.23 42.02,36.23 40.73,34.94 40.3,34.94 39.55,35.69 v36.86,35.69 | v12.13,45.04 11.7,45.47 11.7,46.44 U2.4 | v8.37,85.57 5.68,88.26 J4.P2 | v15.9,59.55 21.7,59.55 31.16,50.09 34.28,50.09 v36.75,52.57
  Bottom 0.15: v55.67,22.25 55.67,25.59 v44.49,36.77 43.31,37.95 43.31,39.67 36.75,46.23 v36.75,52.57 | v12.13,45.04 21.49,35.69 v36.86,35.69 | v8.37,85.57 8.37,67.08 v15.9,59.55
TX  (via drill 0.3)
  Top 0.15: v12.35,65.9 11.7,65.25 11.7,63.96 U2.25 | v87.92,106.1 89,107.18 TP1.TP
  Bottom 0.15: v12.35,65.9 17.08,65.9 24.28,73.1 54.92,73.1 v87.92,106.1
USB_D+
  Top 0.15: D1.1 150.49,53.86 150.49,55.15 148.44,57.19 144.79,57.19 138.12,63.85 98.46,63.85 94.59,59.98 90.29,59.98 88.03,62.24 88.03,64.61 87.81,64.82 87.06,64.82 86.74,64.5 86.74,63.32 84.8,61.38 84.8,59.45 80.18,54.83 68.57,54.83 60.29,46.55 24.39,46.55 U2.14
USB_D-  (via drill 0.3)
  Top 0.15: v148.77,48.7 150.49,50.42 150.49,51.81 D1.3 | v79.54,45.47 23.74,45.47 23.1,46.12 23.1,46.44 U2.13
  Bottom 0.15: v148.77,48.7 148.77,47.52 140.27,39.02 99.75,39.02 87.81,50.95 85.02,50.95 v79.54,45.47
VBAT
  Top 0.3: U4.2 137.26,56.33 137.26,55.9 U4.3 137.16,55.79 136.73,55.79 | 129.63,52.24 127.16,49.77 125.76,49.77 C2_BAT.1 | 129.63,52.24 129.63,53.75 128.66,54.72 128.34,54.72 MCP73831.3 | 129.63,52.24 129.74,52.24 130.81,51.17 134.47,51.17 Q1.3 134.58,51.28 134.58,53.64 136.73,55.79 | TP3.TP 137.48,62.03 137.48,58.05 136.51,57.08 136.51,56.12 136.73,55.9 136.73,55.79
VBUS  (via drill 0.3)
  Top 0.3: C1_BAT.1 132.21,56.22 129.09,56.22 125.87,59.45 TP14.TP 125.65,59.45 119.74,59.45 115.33,55.04 115.33,53.97 117.27,52.03 118.99,52.03 | MCP73831.4 125.65,54.83 124.58,55.9 CHG_LED.A 122.75,55.79 118.99,52.03 | 118.99,52.03 118.99,48.05 119.42,47.62 119.42,45.47 D2.2 119.31,45.47 v118.45,45.47 | 152.1,47.84 153.39,47.84 153.5,47.73 C5_USB.1 | 152.1,47.84 150.06,47.84 | 150.06,47.84 149.2,47.84 C4_USB.1 | 152.1,47.84 152.1,52.35 152.53,52.78 152.96,52.78 D1.5 | 117.38,43.43 116.09,43.43 R1_PWRUSB.2 | 117.38,43.43 121.57,39.24 133.18,39.24 136.94,43 136.94,44.83 | 136.94,44.83 136.94,45.8 133.72,49.02 Q1.1 | 136.94,44.83 141.35,44.83 144.47,41.71 149.63,41.71 PFMF.050.1.2 149.63,41.82 150.06,42.25 v150.06,43.97 | v150.06,47.19 150.06,47.84 | v117.38,43.54 117.38,43.43
  Bottom 0.3: v150.06,43.97 v150.06,47.19 | v118.45,45.47 118.45,44.61 v117.38,43.54
VRTC
  Top 0.15: 89.86,53.1 89.86,53.43 86.2,57.08 86.2,61.49 87.38,62.67 87.38,64.07 R_CAPACITOR.2 | 89.86,53.1 90.5,52.46 C8.1 90.61,52.35 90.72,52.24 94.37,52.24 C10_SUPERCAP.2 | 89.86,53.1 89.53,52.78 85.45,52.78 84.27,51.6 84.27,51.17 U3.14
VUSB  (via drill 0.3)
  Top 0.3: J2.A9 163.71,56.76 163.71,56.65 J2.B4 163.6,56.65 v162.63,56.65 | J2.B9 163.71,52.03 163.71,51.81 J2.A4 163.6,51.71 162.96,51.71 | 162.96,51.71 154.25,43 154.25,41.71 PFMF.050.1.1 | v162.63,52.14 162.96,51.81 162.96,51.71
  Bottom 0.3: v162.63,52.14 v162.63,56.65